# EAGLE schematic Zwischenplatine (EAGLE 8.5.1)
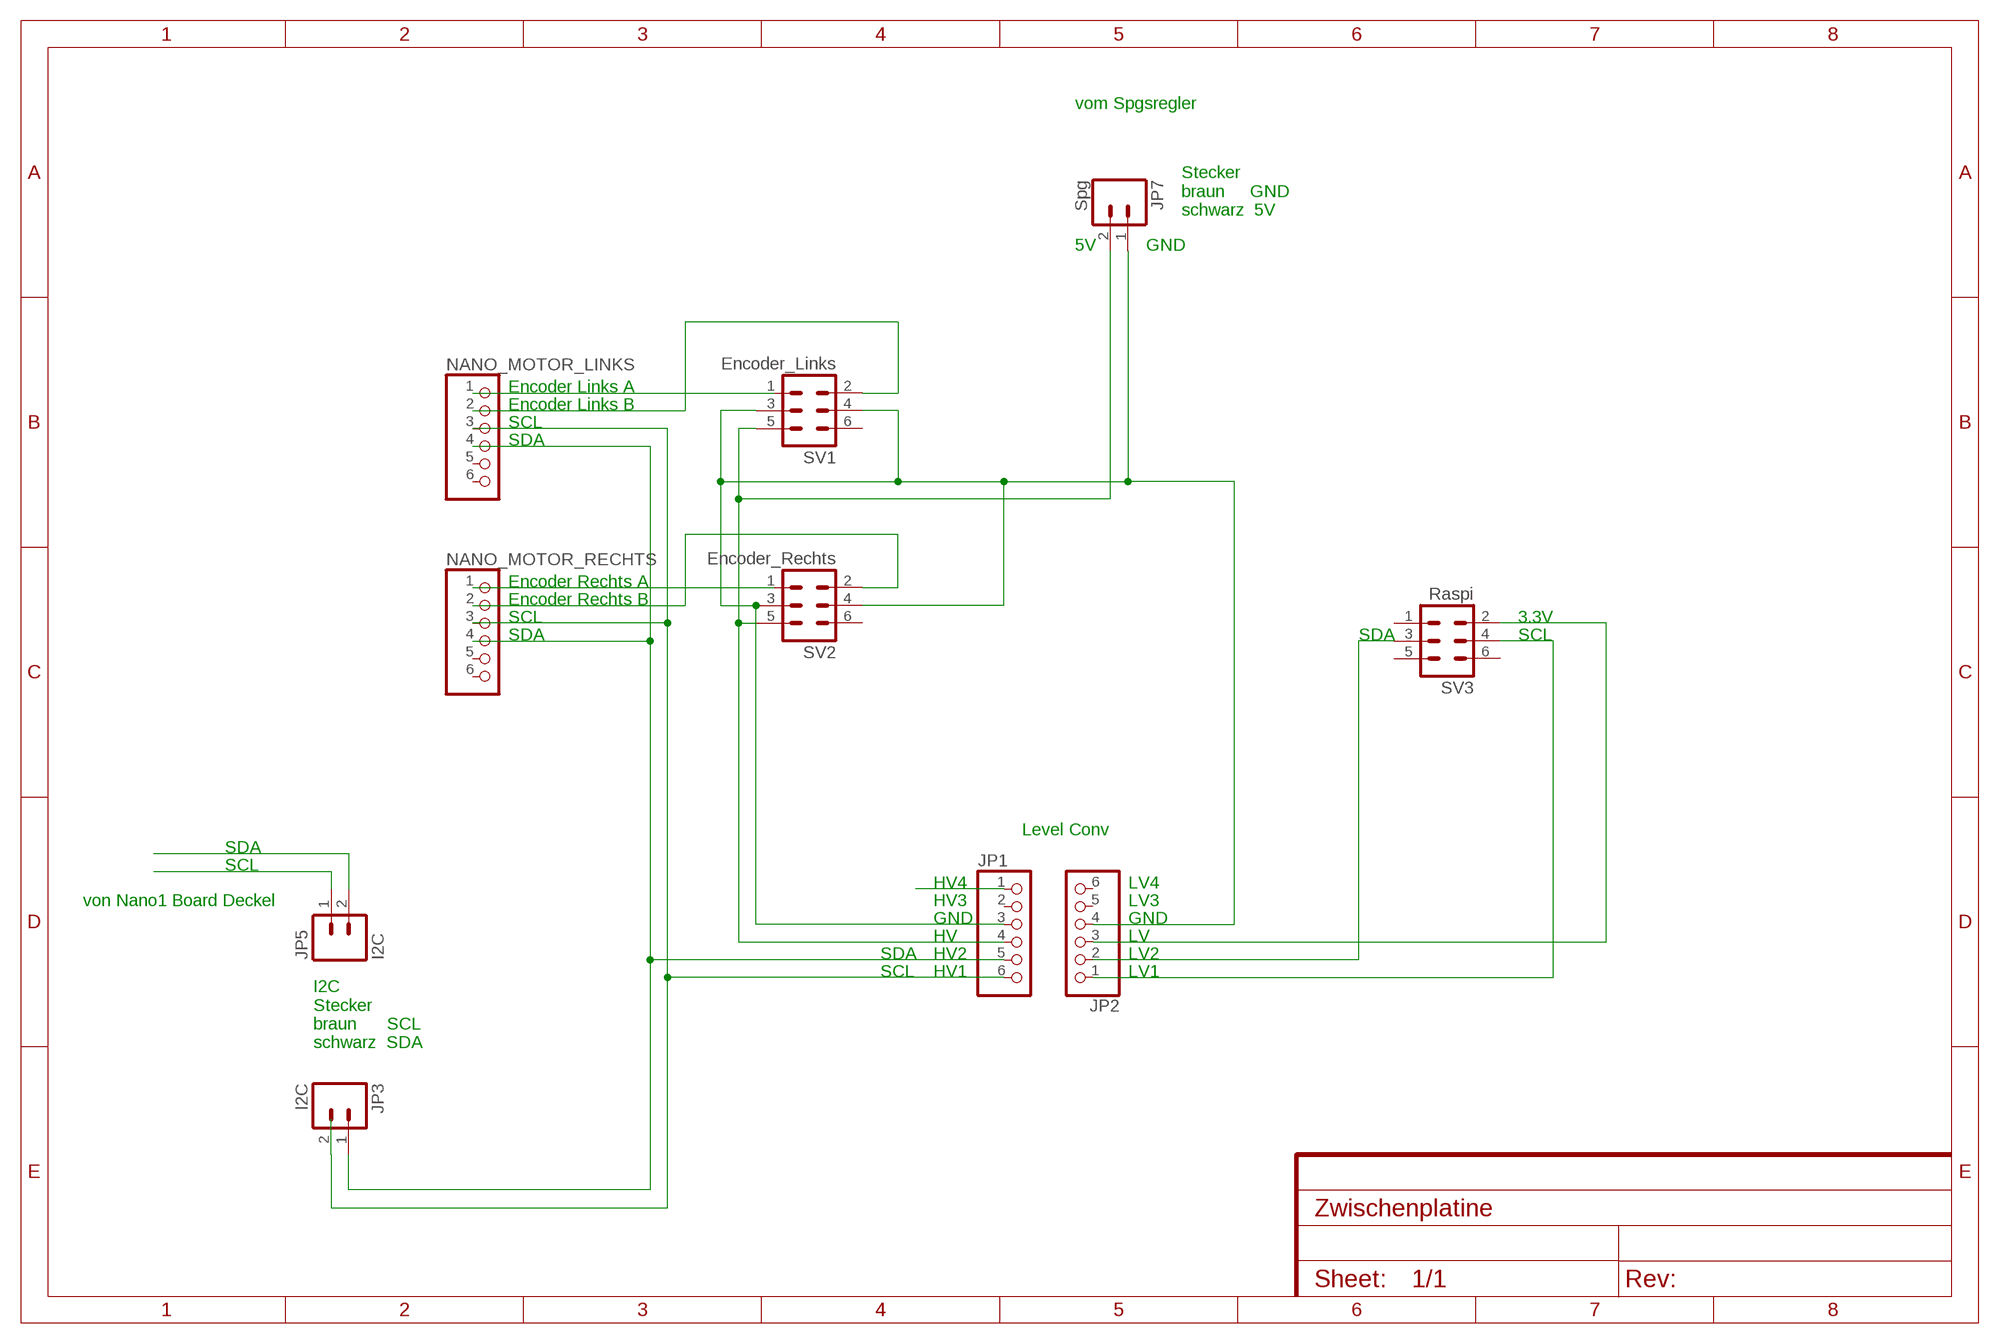
[diagram p0: schematic, sheet 1]

## Parts
JP1  PINHD-1X6B  [1X06-BIG]
JP2  PINHD-1X6B  [1X06-BIG]
JP3  I2C  M02-JST-2MM-SMT  [JST-2-SMD]
JP5  I2C  M02-JST-2MM-SMT  [JST-2-SMD]
JP7  Spg  M02-JST-2MM-SMT  [JST-2-SMD]
NANO_MOTOR_LINKS  PINHD-1X6B  [1X06-BIG]
NANO_MOTOR_RECHTS  PINHD-1X6B  [1X06-BIG]
SV1  Encoder_Links  ML6  [ML6]
SV2  Encoder_Rechts  ML6  [ML6]
SV3  Raspi  ML6  [ML6]

## Nets
N$1 [power usb]: JP1.4 JP7.2 SV1.5 SV2.5
N$2: JP5.1
N$3: JP1.1
N$5: JP5.2
N$6: NANO_MOTOR_RECHTS.1 SV2.1
N$7: NANO_MOTOR_RECHTS.2 SV2.2
N$8: NANO_MOTOR_LINKS.1
N$9: JP1.6 JP3.2 NANO_MOTOR_LINKS.3 NANO_MOTOR_RECHTS.3
N$10: NANO_MOTOR_LINKS.2 SV1.2
N$11: JP1.3 JP2.4 JP7.1 SV1.3 SV1.4 SV2.3 SV2.4
N$12: JP2.3 SV3.2
N$13: JP2.2 SV3.3
N$14: JP2.1 SV3.4
N$16: JP1.5 JP3.1 NANO_MOTOR_LINKS.4 NANO_MOTOR_RECHTS.4
Unconnected: JP1.2 JP2.5 JP2.6 NANO_MOTOR_LINKS.5 NANO_MOTOR_LINKS.6 NANO_MOTOR_RECHTS.5 NANO_MOTOR_RECHTS.6 SV1.1 SV1.6 SV2.6 SV3.1 SV3.5 SV3.6

## Notes on the sheet
- vom Spgsregler
- Stecker
  braun     GND
  schwarz  5V
- 5V | GND
- Encoder Links A
- Encoder Links B
- SCL
- SDA
- Encoder Rechts A
- Encoder Rechts B
- SCL | 3.3V
- SDA | SDA | SCL
- Level Conv
- SDA
- SCL
- HV4 | LV4
- von Nano1 Board Deckel | HV3 | LV3
- GND | GND
- HV | LV
- SDA | HV2 | LV2
- SCL | HV1 | LV1
- I2C
  Stecker
  braun      SCL
  schwarz  SDA

## Library data of the parts
JP1 JP2 NANO_MOTOR_LINKS NANO_MOTOR_RECHTS = adafruit:PINHD-1X6: PIN HEADER
JP3 JP5 JP7 = SparkFun-Connectors:M02: Standard 2-pin 0.1" header. Use with - straight break away headers ( PRT-00116) - right angle break away headers (PRT-00553) - swiss pins (PRT-00743) - machine pins (PRT-00117) - female headers (PRT-00115) Molex polarized connector foot print use with: PRT-08233 with associated crimp pins and housings. 2.54_SCREWTERM for use with PRT-10571. 3.5mm Screw Terminal footprints for PRT-08084 5mm Screw Terminal footprints for use with PRT-08432; PROD_ID: CONN-08352
SV1-SV3 = con-ml:ML6: HARTING; OC_FARNELL: unknown; OC_NEWARK: unknown

## Net classes
0 default: width 0.203 mm, drill 0.406 mm, clearance 0.203 mm
1 power: width 0.61 mm, drill 0.406 mm, clearance 0.203 mm
2 gnd: width 0.305 mm, drill 0.406 mm, clearance 0.203 mm
3 power usb: width 0.508 mm, drill 0.406 mm, clearance 0.203 mm